# EAGLE design LB_BIT_o6_BUZZER-v03(3_3) (EAGLE 6.6.0)
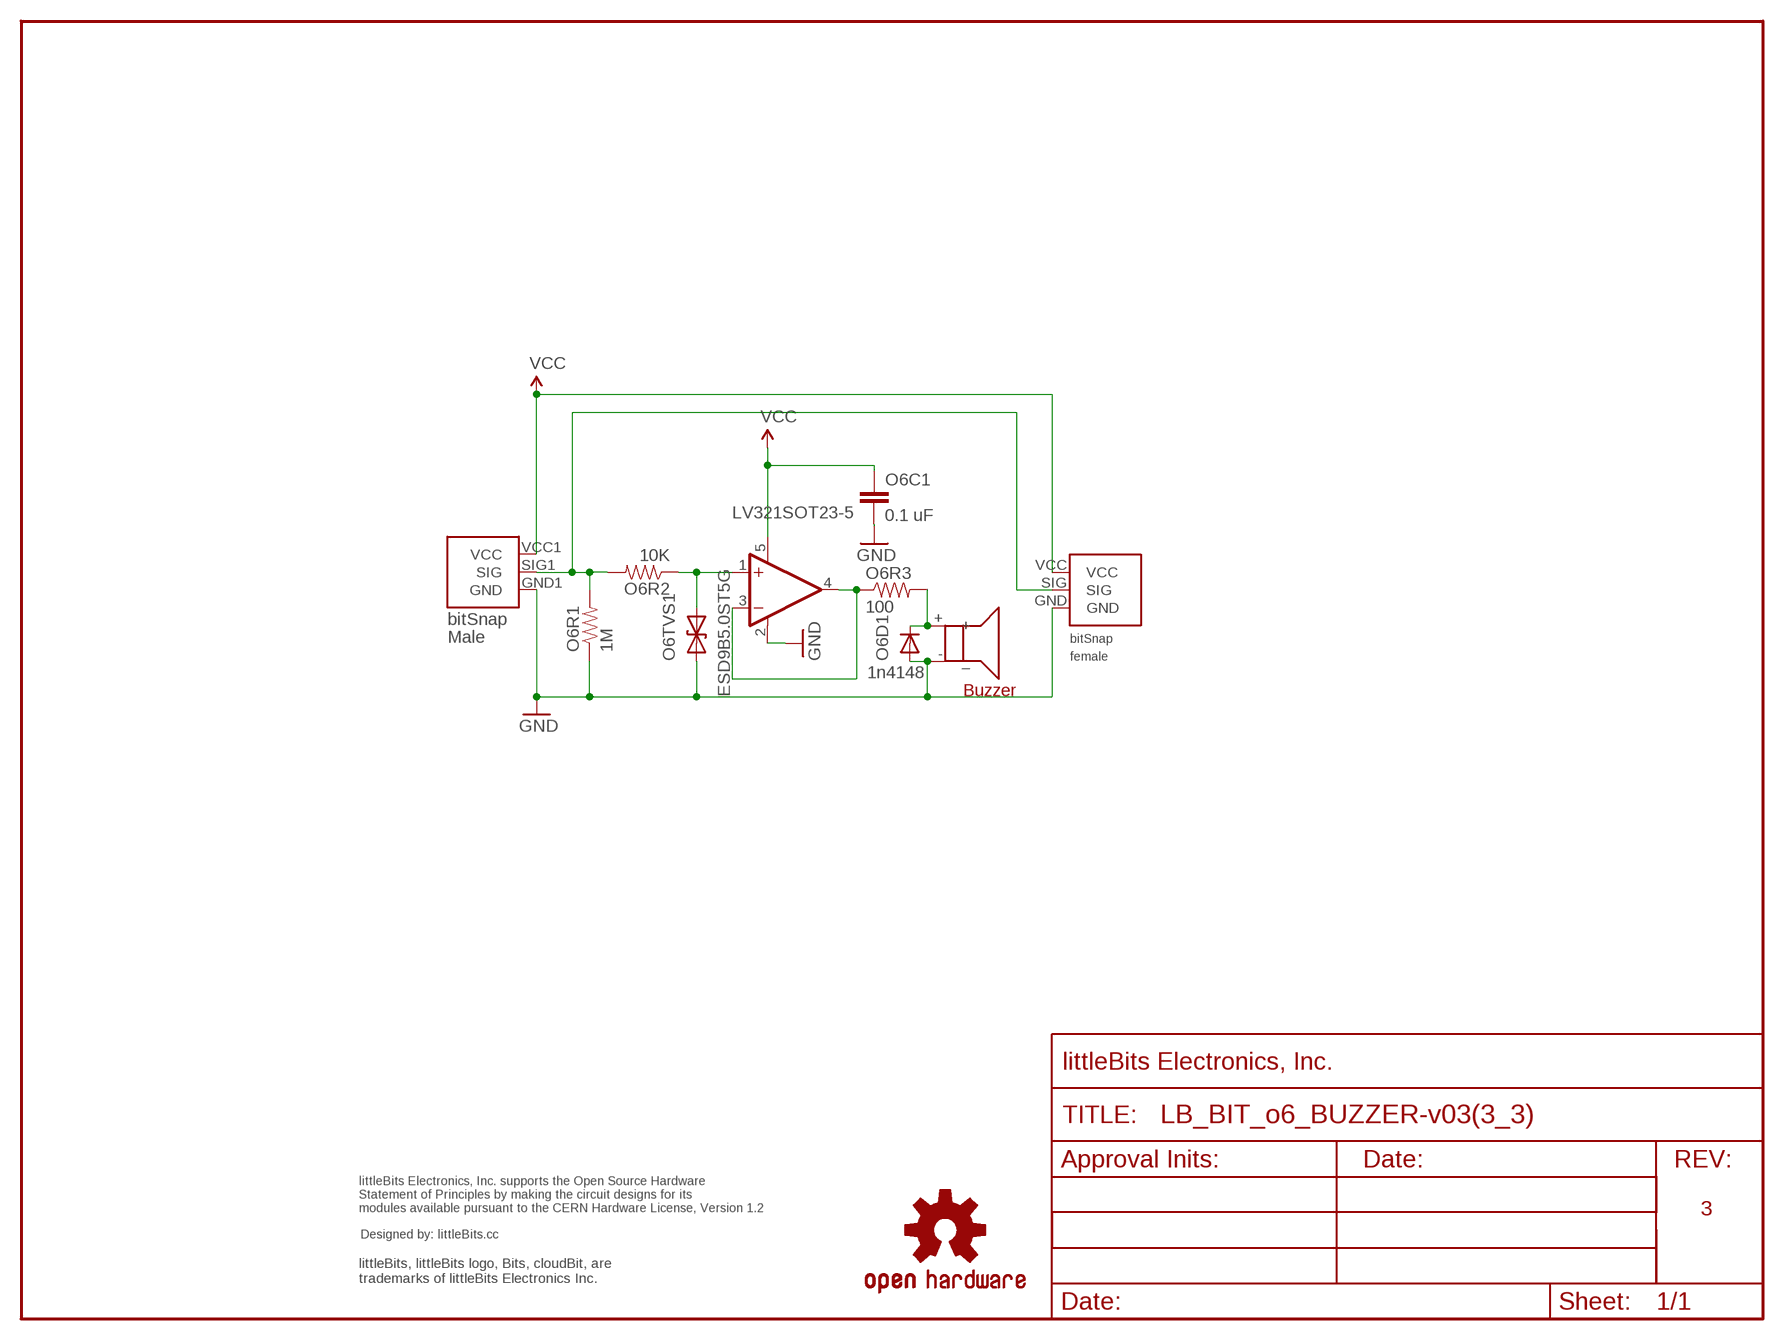
[diagram p0: schematic, sheet 1]

## Parts
O6BSF1  BITSNAP_V03_FEMALE  [BITSNAP_V03_FEMALE]
O6BSM1  BITSNAP_V03_MALE  [BITSNAP_V03_MALE]
O6C1  0.1 uF  CAPCAP-0603  [CAP-0603]
O6D1  1n4148  DIODESOD  [SOD-323]
O6R1  1M  RESISTOR0603  [RES-0603]
O6R2  10K  RESISTOR0603  [RES-0603]
O6R3  100  RESISTOR0603  [RES-0603]
O6TVS1  ESD9B5.0ST5G  DIODE-TVSSOD-923  [SOD-923]
O6U1  LV321SOT23-5  [SOT23-5]
O6U2  BUZZER-JSH2317AT  [BUZZER-JSH2317AT]
U$1  FRAME-LETTER-OHWOHW  [FABDWG01-OHW]
U$2  OSHWCREDIT  [OSHWCREDIT]
U$16  OSHW-LOGOL  [OSHW-LOGO-L]

## Nets
GND: O6BSF1.GND O6BSM1.GND1(GND) O6C1.2 O6D1.2(A) O6R1.1 O6TVS1.1(A) O6U1.2(V-) O6U2.-(_)
N$2: O6D1.1(C) O6R3.2 O6U2.+
N$3: O6R2.1 O6TVS1.2(C) O6U1.1(+IN)
N$6: O6BSF1.SIG O6BSM1.SIG1(SIG) O6R1.2 O6R2.2
N$8: O6R3.1 O6U1.3(-IN) O6U1.4(OUT)
VCC: O6BSF1.VCC O6BSM1.VCC1(VCC) O6C1.1 O6U1.5(V+)

## Notes on the sheet
- 3

## Library data of the parts
O6BSF1 = bitSnap:BITSNAP_V03_FEMALE
O6BSM1 = bitSnap:BITSNAP_V03_MALE
O6C1 = LITTLEBITS:CAP
O6D1 = LITTLEBITS:DIODE: Diode These are standard reverse protection diodes and small signal diodes. SMA package can handle up to about 1A. SOD-323 can handle about 200mA. What the SOD-323 package when ordering, there are some mfgs out there that are 5-pin packages.
O6R1-O6R3 = LITTLEBITS:RESISTOR
O6TVS1 = LITTLEBITS:DIODE-TVS: Bidirectional Transient Voltage Suppression Diode: Device conducts in avalanche mode after reaching a part dependent voltage threshold. Used for limiting voltage spikes on ESD sensitive inputs and outputs.; IEC_ESD_PROT0: +/-18kV; LB_PN: ?; MPN: ESD9B5.0ST5G; V_CLAMP: ?; V_OPERATION: 5V
O6U1 = LITTLEBITS:LV321
O6U2 = LITTLEBITS:BUZZER-JSH2317AT
U$1 = LITTLEBITS:FRAME-LETTER-OHW
U$2 = LITTLEBITS:OSHWCREDIT
U$16 = SparkFun_NEW:OSHW-LOGO: Open Source Hardware Logo This logo indicates the piece of hardware it is found on incorporates a OSHW license and/or adheres to the definition of open source hardware found here: http://freedomdefined.org/OSHW

## Board
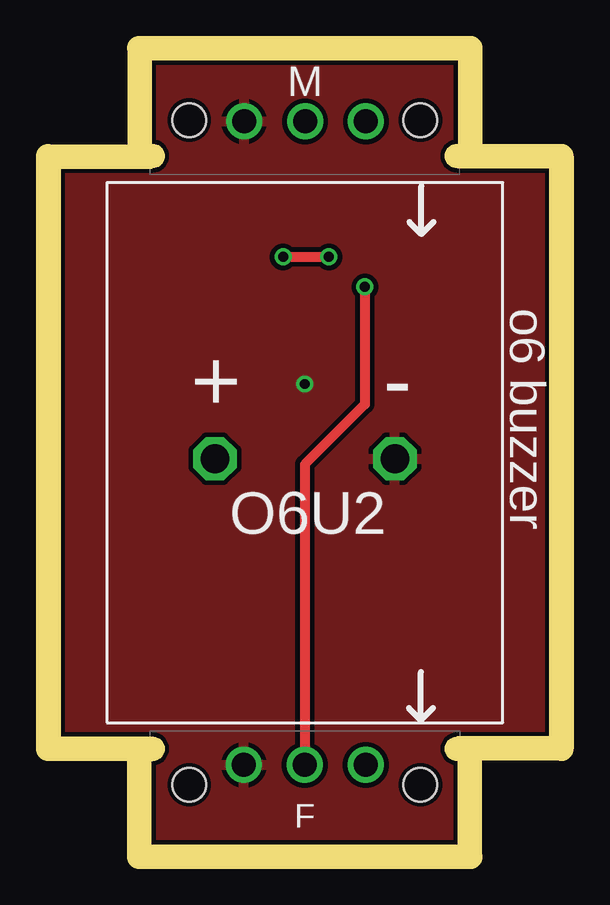
[diagram p1: board, top side]
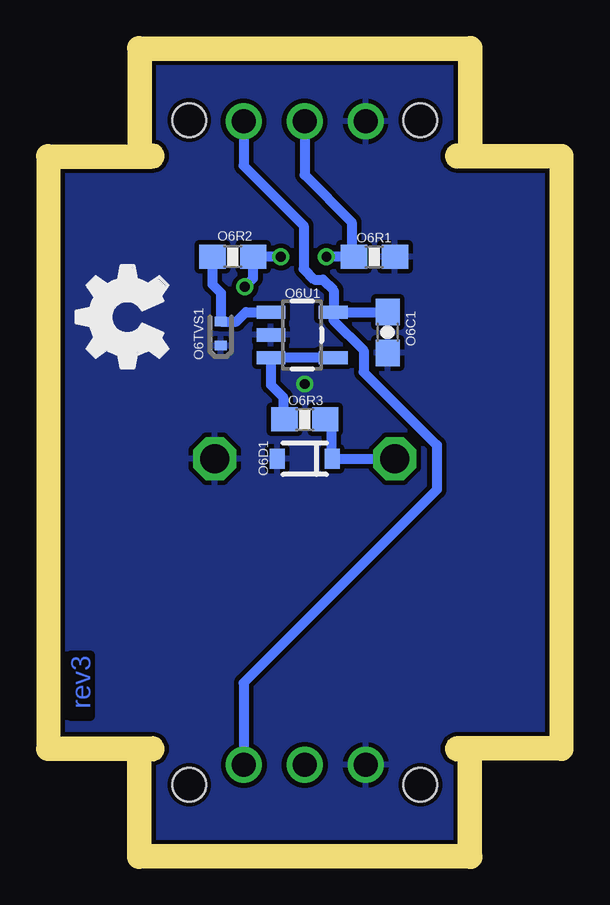
[diagram p2: board, bottom side, seen from below]

Size 20.4 x 32.7 mm. Coordinates in mm from the lower left corner, seen from the top.
Outline: 20.4,4.5 20.4,28.2
Outline: 0,28.2 0,4.5
Copper layers (1*16): Top 0.035mm / dielectric 1.5mm / Bottom 0.035mm
Design rules "default": minimum track width 0.2mm, minimum drill 0.4mm, track to track 0.2mm, track to pad 0.2mm, pad to pad 0.2mm, via to via 0.2mm, smd to smd 0mil, copper to edge 0.2mm, drill to drill 0.2mm, minimum pad ring 0.2mm, minimum via ring 0.15mm, stop-mask expansion 0.1mm, vias tented up to drill 0mil, thermal gap 0.2mm
Milling: 2 lines

### Footprints (pad centres in the part's own frame; a part is rotated, then mirrored left to right if it is on the bottom)
BITSNAP_V03_FEMALE = drill 1: GND 3.91,3.33; SIG 6.45,3.33; VCC 8.99,3.33 | hole 1.4: 1.63,2.5; 11.27,2.5
BITSNAP_V03_MALE = drill 1: GND1 8.98,2.56; SIG1 6.44,2.56; VCC1 3.9,2.56 | hole 1.4: 11.27,2.5; 1.63,2.5
CAP-0603 = smd 1.1 x 1: 1 -0.85,0; 2 0.85,0
SOD-323 = smd 0.63 x 0.83: 1 -1.15,0; 2 1.15,0
RES-0603 = smd 1.1 x 1: 1 -0.85,0; 2 0.85,0
SOD-923 = smd 0.4 x 0.5: 1 -0.5,0; 2 0.5,0
SOT23-5 = smd 0.55 x 1.2: 1 -0.95,-1.3; 2 0,-1.3; 3 0.95,-1.3; 4 0.95,1.3; 5 -0.95,1.3
BUZZER-JSH2317AT = drill 1.2 octagon: + 4.5,11; - 12,11

### Placement (x,y rotation side)
O6BSF1  3.75,0 0 top
O6BSM1  16.65,32.7 180 top
O6C1  6.75,21.35 270 bottom
O6D1  10.2,16.09 180 bottom
O6R1  7.3,24.5 180 bottom
O6R2  13.2,24.5 0 bottom
O6R3  10.2,17.72 0 bottom
O6TVS1  13.7,21.3 90 bottom
O6U1  10.31,21.24 270 bottom
O6U2  1.96,5.09 0 top
U$1  0,0 0 top
U$2  -93.35,-64.55 0 top  (outside the outline)
U$7  [OSHW_FILLX150_NOTEXT]  15.91,19.04 0 top
U$16  -33.35,-69.16 0 top  (outside the outline)

### Tracks (layer width: path | path; a pad name or v marks a point on that pad's centre or on a via)
GND  (via drill 0.41)
  other vias: 10.2,19.2
  pour Top: 0.22,32.46 20.15,32.46 20.15,0.22 0.22,0.22
  pour Bottom: 0.22,32.46 20.15,32.46 20.15,0.22 0.22,0.22
N$2
  Bottom 0.406: O6U2.+ O6D1.1 9.1,16.09 9.1,17.65 O6R3.2
N$3
  Bottom 0.406: O6R2.1 14.05,23.35 13.7,23 O6TVS1.2 13.05,21.8 12.65,22.2 O6U1.1
N$6  (via drill 0.41)
  Top 0.406: v9.3,24.5 v11.2,24.5 | v12.7,23.25 12.7,18.35 10.2,15.85 O6BSF1.SIG
  Bottom 0.406: O6BSM1.SIG1 10.21,27.91 8.25,25.95 8.25,24.6 O6R1.2 | 8.4,24.55 O6R1.2 | O6R1.2 v9.3,24.5 | v11.2,24.5 O6R2.2 12.35,23.6 v12.7,23.25
N$8
  Bottom 0.406: O6U1.4 O6U1.3 11.61,19.16 11.1,18.65 11.11,17.75 O6R3.1
VCC
  Bottom 0.406: O6U1.5 O6C1.1 | O6U1.5 9.01,21.86 7.75,20.6 7.75,19.7 4.7,16.65 4.7,14.8 12.75,6.75 O6BSF1.VCC | O6BSM1.VCC1 12.75,28.3 10.25,25.8 10.25,24 9.8,23.55 9.45,23.55 9,23.1 9,22.2 O6U1.5

### Text on the board
Bottom: rev3
tPlace: o6 buzzer
tNames: O6U2
Milling: 1mm DIA. ROUTER PATH
dxf: 3 | BUZZER BIT